# EAGLE schematic rc_hpf (EAGLE 6.4)
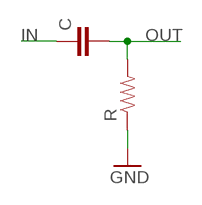
[diagram p0: schematic, sheet 1]

## Parts
C  CAP0402-CAP  [0402-CAP]
R  RESISTOR0402-RES  [0402-RES]

## Nets
OUT: C.2 R.2
Unconnected: C.1 R.1

## Library data of the parts
C = SparkFun-Passives:CAP: Capacitor Standard 0603 ceramic capacitor, and 0.1" leaded capacitor.
R = SparkFun-Passives:RESISTOR: Resistor Basic schematic elements and footprints for 0603, 1206, and PTH resistors.